# EAGLE design rfm69_pro_mini (EAGLE 7.7.0)
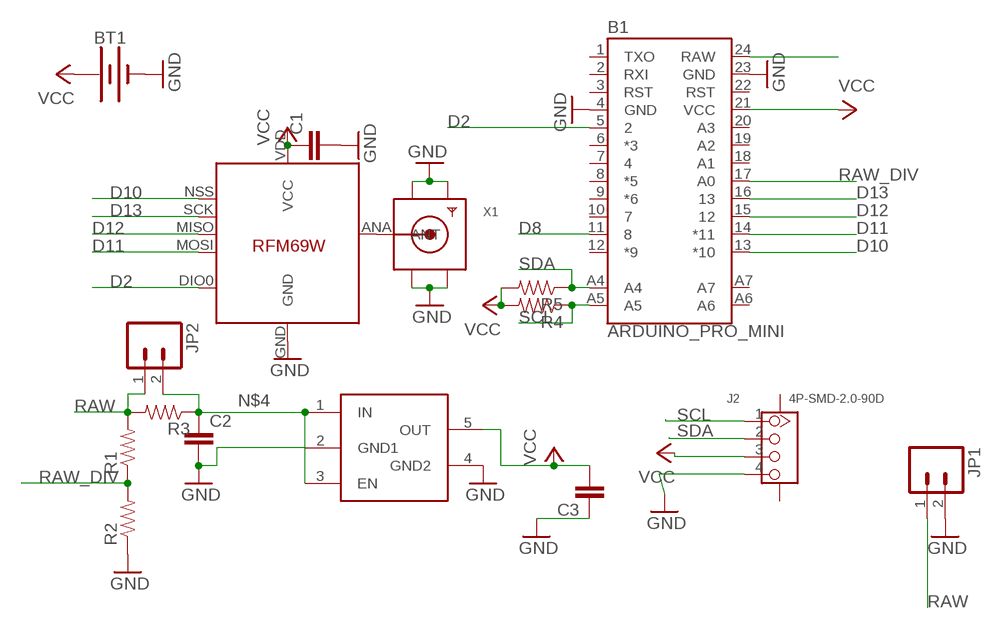
[diagram p0: schematic, sheet 1]

## Parts
B1  ARDUINO_PRO_MINI  [ARDUINO_PRO_MINI]
BT1  BATTERY-20MM_PTH  [BATTCOM_20MM_PTH]
C1  CAP0805-CAP  [0805-CAP]
C2  CAP0805-CAP  [0805-CAP]
C3  CAP0805-CAP  [0805-CAP]
J2  4P-SMD-2.0-90D  GROVE-CONNECTOR-SMD-90D(4+2P-2.0)  [HW4-SMD-2.0-90D]
JP1  M02PTH  [1X02]
JP2  M02PTH  [1X02]
R1  RESISTOR0805-RES  [0805-RES]
R2  RESISTOR0805-RES  [0805-RES]
R3  RESISTOR0805-RES  [0805-RES]
R4  RESISTOR0805-RES  [0805-RES]
R5  RESISTOR0805-RES  [0805-RES]
U$1  TPS783  [SOT23-5]
U$2  RFM69  [RFM69W-MINPADS]
X1  SMACONNECTOR  [SMA90_DIP]

## Nets
D2: B1.5 U$2.DIO0
D8: B1.11
D10: B1.13(*10) U$2.NSS(SEL)
D11: B1.14(*11) U$2.MOSI
D12: B1.15 U$2.MISO
D13: B1.16 U$2.SCK
GND: B1.4(GND) B1.23(GND) BT1.2(-) C1.2 C2.2 C3.1 J2.4 JP1.2 R2.1 U$1.2(GND1) U$1.4(GND2) U$2.GND X1.GND1 X1.GND2 X1.GND3 X1.GND4
N$1: U$2.ANA(ANT) X1.ANTENNA(ANT)
N$2: B1.24(RAW)
N$4: C2.1 JP2.2 R3.1 U$1.1(IN) U$1.3(EN)
RAW: JP1.1 JP2.1 R1.2 R3.2
RAW_DIV: B1.17(A0) R1.1 R2.2
SCL: B1.A5 J2.1 R4.1
SDA: B1.A4 J2.2 R5.1
VCC: B1.21(VCC) BT1.1(+) C1.1 C3.2 J2.3 R4.2 R5.2 U$1.5(OUT) U$2.VDD(VCC)
Unconnected: B1.1(TXO) B1.2(RXI) B1.3(RST) B1.6(*3) B1.7 B1.8(*5) B1.9(*6) B1.10 B1.12(*9) B1.18(A1) B1.19(A2) B1.20(A3) B1.22(RST) B1.A6 B1.A7 J2.SS1 J2.SS2

## Library data of the parts
B1 = SparkFun-Boards:ARDUINO_PRO_MINI: SparkFun Pro Mini Pro Mini compatible footprint. Dimensions: 0.7 x 1.3" PCB Thickness: 0.8mm SparkFun Products: 3.3V/8MHz <https://www.sparkfun.com/products/11114> 5V/16MHz <https://www.sparkfun.com/products/11113>
BT1 = SparkFun-Batteries:BATTERY: Battery - Single Cell A variety of battery chemistries, sizes, and footprints. Device List: 20MM_PTH - Coin Cell Battery Holder - 20mm (PTH) <https://www.sparkfun.com/products/783> 12MM_SMD - Coin Cell Battery Holder - 12mm (SMD) <https://www.sparkfun.com/products/10592> 12MM_PTH - Coin Cell Battery Holder - 12mm (PTH) <https://www.sparkfun.com/products/7948> 20MM_SMD - 20mm Coin Cell Battery Holder (SMD) (2 legs) Used on the Big Time Watch Kit <https://www.sparkfun.com/products/11734> 20MM_SMD_4LEGS - Coin Cell Battery Holder - 20mm (SMD) <https://www.sparkfun.com/products/11892> 20MM_SMD_4LEGS_OVERPASTE - Coin Cell Battery Holder - 20mm (SMD) <https://www.sparkfun.com/products/11892> (Over-paste on the legs) 24.5MM_PTH - Coin Cell Battery Holder - 24.5mm (PTH) <https://www.sparkfun.com/products/8863> 9V - 9V Battery Holder - PC Mount Used on the SparkFun SparkPunk Sound Kit <https://www.sparkfun.com/products/11177> and SparkFun SparkPunk Sequencer Kit <https://www.sparkfun.com/products/12707> 18650 - Battery Holder - 18650 (PTH) <https://www.sparkfun.com/products/13113> AA - Battery Holder - 1xAA (PTH) <https://www.sparkfun.com/products/7949> AAA - Battery Holder - 1xAAA (PTH) <https://www.sparkfun.com/products/12718> AA_KIT - Battery Holder - 1xAA (PTH) <https://www.sparkfun.com/products/7949> Special kit package - pads only have exposed copper on one side of the board. AAA_KIT - Battery Holder - 1xAAA (PTH) <https://www.sparkfun.com/products/12718> Special kit package - pads only have exposed copper on one side of the board.; PROD_ID: BATT-09031; SF_SKU: PRT-00783
C1-C3 = LowPowerLab:CAP: Capacitor Standard 0603 ceramic capacitor, and 0.1" leaded capacitor.
J2 = Seeed-OPL-Connector:GROVE-CONNECTOR-SMD-90D(4+2P-2.0): 320110032
JP1 JP2 = mike-temp:M02: Header 2 Standard 2-pin 0.1" header. Use with straight break away headers (SKU : PRT-00116), right angle break away headers (PRT-00553), swiss pins (PRT-00743), machine pins (PRT-00117), and female headers (PRT-00115). Molex polarized connector foot print use with SKU : PRT-08233 with associated crimp pins and housings.
R1-R5 = LowPowerLab:RESISTOR: Resistor Basic schematic elements and footprints for 0603, 1206, and PTH resistors.
U$1 = jpiat:TPS783
U$2 = LowPowerLab:RFM69
X1 = adafruit:SMACONNECTOR: SMA Connector 90° DIP SMA Connector, 50 Ohm (4UConnector: 07259)

## Board
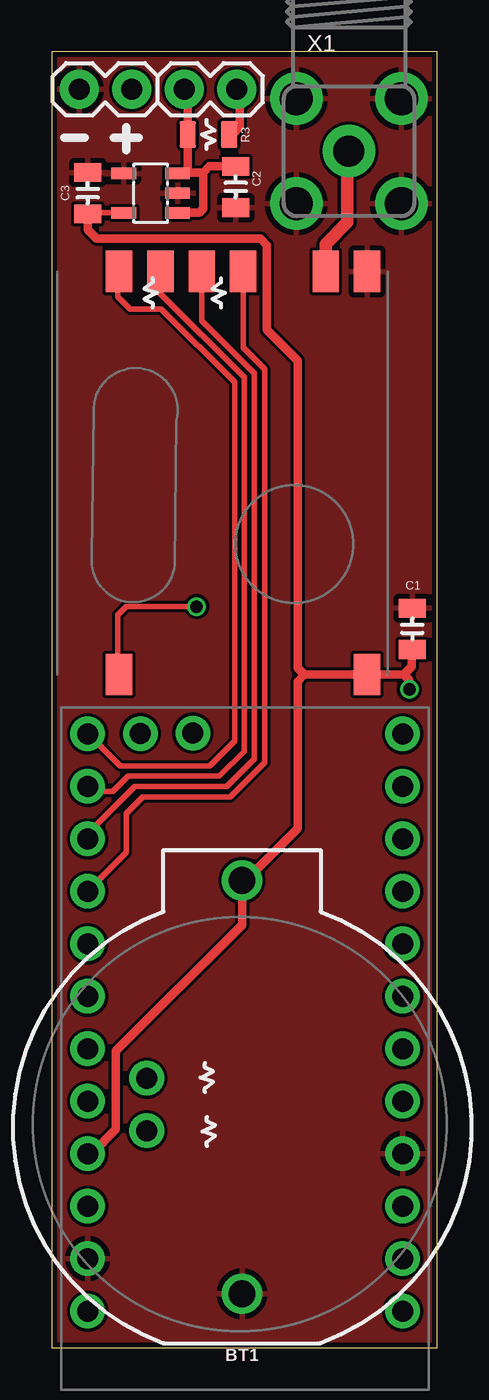
[diagram p1: board, top side]
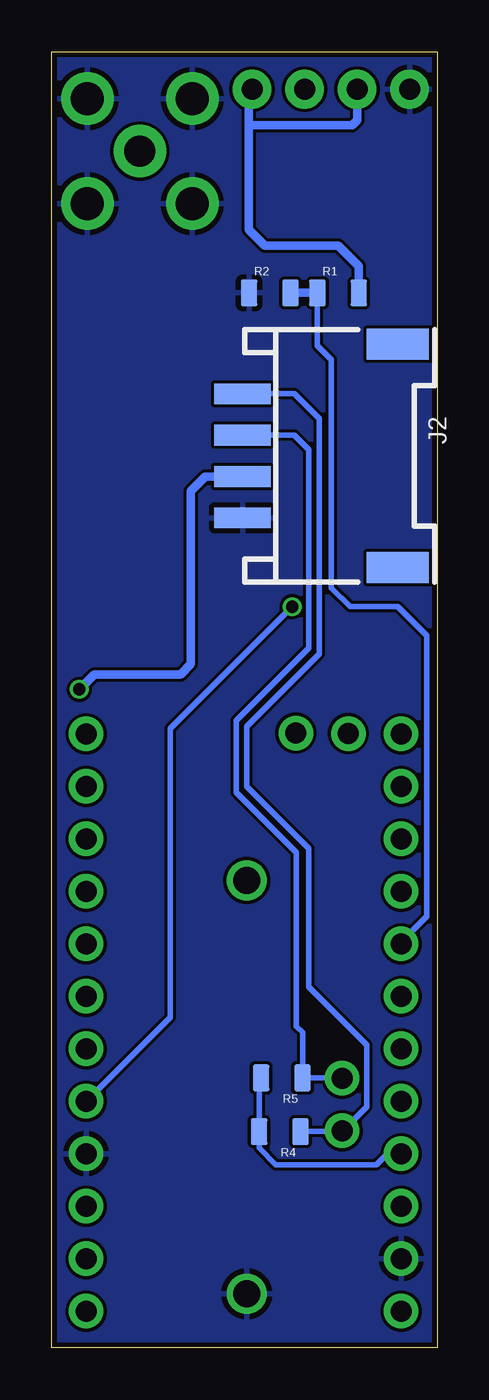
[diagram p2: board, bottom side, seen from below]

Size 18.64 x 62.73 mm. Coordinates in mm from the lower left corner, seen from the top.
Outline: 0,0 18.64,0 18.64,62.73 0,62.73 0,0
Copper layers (1*16): Top 0.035mm / dielectric 1.5mm / Bottom 0.035mm
Design rules "SeeedStudio_2layer_DRU_no_angle_20140221": minimum track width 6mil, minimum drill 12mil, track to track 6mil, track to pad 6mil, pad to pad 6mil, via to via 6mil, smd to smd 0mil, copper to edge 10mil, drill to drill 10mil, minimum pad ring 10mil, minimum via ring 6mil, stop-mask expansion 2mil, vias tented up to drill 100mil, thermal gap 10mil

### Footprints (pad centres in the part's own frame; a part is rotated, then mirrored left to right if it is on the bottom)
ARDUINO_PRO_MINI = drill 1.016 pad 1.676: 1 -7.62,12.7; 2 -7.62,10.16; 3 -7.62,7.62; 4 -7.62,5.08; 5 -7.62,2.54; 6 -7.62,0; 7 -7.62,-2.54; 8 -7.62,-5.08; 9 -7.62,-7.62; 10 -7.62,-10.16; 11 -7.62,-12.7; 12 -7.62,-15.24; 13 7.62,-15.24; 14 7.62,-12.7; 15 7.62,-10.16; 16 7.62,-7.62; 17 7.62,-5.08; 18 7.62,-2.54; 19 7.62,0; 20 7.62,2.54; 21 7.62,5.08; 22 7.62,7.62; 23 7.62,10.16; 24 7.62,12.7; A4 4.763,1.429; A5 4.763,3.969; A6 2.527,-15.272; A7 5.067,-15.246
BATTCOM_20MM_PTH = drill 1.3: 1 11.85,0; 2 -8.15,0
0805-CAP = smd 0.902 x 1.3: 1 -1,0; 2 1,0
HW4-SMD-2.0-90D = smd 1.01 x 2.74: 1 -3,-0.1; 2 -1,-0.1; 3 1,-0.1; 4 3,-0.1 | smd 1.5 x 3: SS1 -5.4,7.4; SS2 5.4,7.4
1X02 = drill 1.016 pad 1.88: 1 0,0; 2 2.54,0
0805-RES = smd 0.8 x 1.3: 1 -1,0; 2 1,0
SOT23-5 = smd 0.55 x 1.2: 1 -0.95,-1.3; 2 0,-1.3; 3 0.95,-1.3; 4 0.95,1.3; 5 -0.95,1.3
RFM69W-MINPADS = smd 2 x 1.27: ANA 8,-5; DIO0 -11.5,5; GND 8,-7; MISO 8,1; MOSI 8,3; NSS 8,5; SCK 8,-1; VDD -11.5,-7
SMA90_DIP = drill 1.5 pad 2.54: ANTENNA 0,0 | drill 1.6 pad 2.54: GND1 -2.54,2.54; GND2 2.54,2.54; GND3 -2.54,-2.54; GND4 2.54,-2.54

### Placement (x,y rotation side)
B1  9.36,14.48 180 top
BT1  9.21,10.77 90 top
C1  17.45,34.8 90 top
C2  8.9,56.18 270 top
C3  1.74,55.88 270 top
J2  9.31,43.17 270 bottom
JP1  3.87,60.91 180 top
JP2  8.95,60.91 180 top
R1  4.79,51.05 0 bottom
R2  8.09,51.05 0 bottom
R3  7.58,58.72 0 top
R4  7.61,10.47 180 bottom
R5  7.51,13.07 180 bottom
U$1  4.79,55.88 90 top
U$2  8.26,44.09 90 top
X1  14.38,57.92 0 top

### Tracks (layer width: path | path; a pad name or v marks a point on that pad's centre or on a via)
D2  (via drill 0.6)
  Top 0.254: v7.01,35.87 3.61,35.87 3.21,35.47 3.21,32.64 U$2.DIO0
  Bottom 0.254: B1.5 12.92,16 12.92,29.97 7.84,35.05 7.82,35.05 v7.01,35.87
D10
  Top 0.254: B1.13 1.76,29.72 3.31,28.17 7.65,28.17 8.85,29.37 8.85,46.72 5.31,50.27 3.81,50.27 3.21,50.87 3.21,52.04 U$2.NSS
D11
  Top 0.254: 1.74,26.92 2.96,26.92 3.71,27.67 8.11,27.67 9.31,28.86 9.31,46.97 5.26,51.02 U$2.MOSI
  Top 0.406: 1.74,26.92 B1.14
D12
  Top 0.254: B1.15 1.74,24.9 4.01,27.17 8.48,27.17 9.81,28.5 9.81,47.17 7.26,49.72 U$2.MISO
D13
  Top 0.254: B1.16 3.61,23.97 3.61,25.87 4.41,26.67 8.64,26.67 10.31,28.34 10.31,47.37 9.26,48.42 U$2.SCK
GND
  pour Top: 23.58,65.02 23.58,-8.13 -6.13,-8.13 -6.13,65.02
  pour Bottom: -5.88,66.04 24.6,66.04 24.6,-8.38 -5.88,-8.38
N$1
  Top 0.254: 14.36,57.89 X1.ANTENNA
  Top 0.61: U$2.ANA 13.26,53.42 14.31,54.47 14.31,57.84 X1.ANTENNA
N$4
  Top 0.254: 6.14,56.88 U$1.3 6.07,56.84 | 6.58,57.12 6.82,56.88 | 6.58,60.54 JP2.2
  Top 0.406: 7.33,56.88 6.82,56.88 6.14,56.88 | U$1.1 7.14,54.93 7.33,55.12 7.33,56.88 | 6.58,57.12 R3.1 6.58,60.54 | C2.1 7.63,57.18 7.33,56.88
RAW
  Top 0.254: 8.75,58.59 8.75,58.71 | 9.11,60.55 JP2.1
  Top 0.406: 8.75,58.59 R3.2 | 8.75,58.71 9.11,59.07 9.11,60.55
  Bottom 0.254: 9.11,59.77 9.11,59.94
  Bottom 0.406: R1.2 3.79,52.34 4.79,53.34 8.34,53.34 9.11,54.1 9.11,59.17 | 9.11,59.17 9.11,59.77 9.11,60.75 JP2.1 | JP1.1 3.87,59.4 4.11,59.17 9.11,59.17
RAW_DIV
  Bottom 0.254: R1.1 5.79,48.5 5.11,47.82 5.11,36.77 4.21,35.87 1.91,35.87 0.51,34.47 0.51,20.87 1.64,19.74 1.74,19.74 B1.17
  Bottom 0.406: R1.1 R2.2
SCL
  Bottom 0.254: J2.1 6.91,46.17 5.71,44.97 5.71,33.57 9.21,30.07 9.21,27.17 6.21,24.17 6.21,17.47 3.41,14.67 3.41,11.67 4.57,10.51 B1.A5 4.64,10.47 R4.1
SDA
  Bottom 0.254: J2.2 6.91,44.17 6.21,43.47 6.21,33.87 9.71,30.37 9.71,26.87 6.81,23.97 6.81,15.57 6.51,15.27 R5.1 4.62,13.07 B1.A4
VCC  (via drill 0.6)
  Top 0.254: U$1.5 1.74,54.93 C3.2 | 17.41,33.76 C1.1
  Top 0.406: C3.2 1.74,54.1 2.17,53.67 10.11,53.67 10.41,53.37 10.41,49.27 11.91,47.77 11.91,32.91 12.23,32.59 | 12.23,32.59 U$2.VDD 17.03,32.59 | 17.03,32.59 17.41,32.97 17.41,33.76 | 12.23,32.59 11.9,32.26 11.9,25.15 9.96,23.21 9.8,23.21 BT1.1 9.21,20.47 3.11,14.37 3.11,10.57 1.94,9.4 B1.21 | v17.31,31.87 17.31,32.31 17.03,32.59
  Bottom 0.254: R5.2 8.61,12.97 R4.2 8.61,9.67 7.81,8.87 2.94,8.87 2.41,9.4 B1.21
  Bottom 0.406: v17.31,31.87 16.59,32.59 12.41,32.59 11.91,33.09 11.91,41.47 11.21,42.17 J2.3